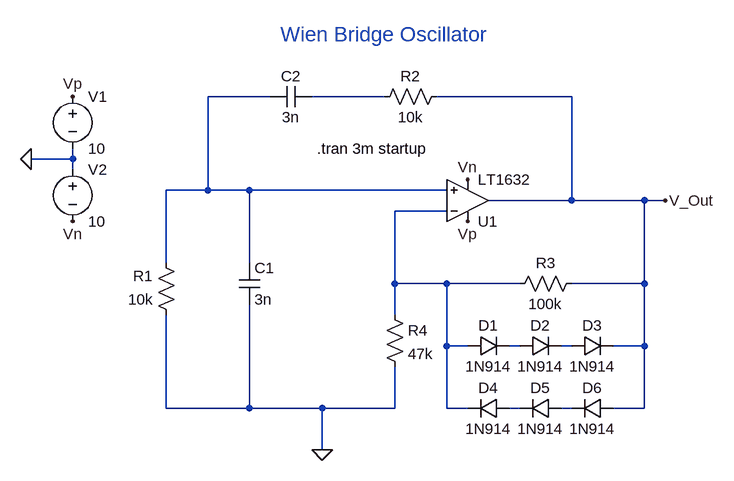
[diagram p0: schematic Wien_Bridge_Oscillator.asc]
Wien_Bridge_Oscillator.asc, the LTspice schematic file:
Version 4.1
SHEET 1 880 680
WIRE -16 0 -112 0
WIRE 160 0 48 0
WIRE 448 0 240 0
WIRE -320 96 -320 80
WIRE -320 96 -384 96
WIRE -320 112 -320 96
WIRE -112 144 -112 0
WIRE -112 144 -176 144
WIRE -48 144 -112 144
WIRE 256 144 -48 144
WIRE 448 160 448 0
WIRE 448 160 320 160
WIRE 560 160 448 160
WIRE 592 160 560 160
WIRE 256 176 176 176
WIRE -176 256 -176 144
WIRE -48 256 -48 144
WIRE 176 288 176 176
WIRE 256 288 176 288
WIRE 368 288 256 288
WIRE 560 288 560 160
WIRE 560 288 448 288
WIRE 176 336 176 288
WIRE 256 384 256 288
WIRE 288 384 256 384
WIRE 368 384 352 384
WIRE 448 384 432 384
WIRE 560 384 560 288
WIRE 560 384 512 384
WIRE -176 480 -176 336
WIRE -48 480 -48 320
WIRE -48 480 -176 480
WIRE 64 480 -48 480
WIRE 176 480 176 416
WIRE 176 480 64 480
WIRE 256 480 256 384
WIRE 288 480 256 480
WIRE 368 480 352 480
WIRE 448 480 432 480
WIRE 560 480 560 384
WIRE 560 480 512 480
WIRE 64 544 64 480
FLAG -320 0 Vp
FLAG 288 192 Vp
FLAG -320 192 Vn
FLAG 288 128 Vn
FLAG 592 160 V_Out
FLAG 64 544 0
FLAG -384 96 0
SYMBOL res 160 320 R0
SYMATTR InstName R4
SYMATTR Value 47k
SYMBOL res 256 -16 R90
WINDOW 0 0 56 VBottom 2
WINDOW 3 32 56 VTop 2
SYMATTR InstName R2
SYMATTR Value 10k
SYMBOL res -160 352 R180
WINDOW 0 36 76 Left 2
WINDOW 3 36 40 Left 2
SYMATTR InstName R1
SYMATTR Value 10k
SYMBOL cap -64 256 R0
SYMATTR InstName C1
SYMATTR Value 3n
SYMBOL cap 48 -16 R90
WINDOW 0 0 32 VBottom 2
WINDOW 3 32 32 VTop 2
SYMATTR InstName C2
SYMATTR Value 3n
SYMBOL voltage -320 -16 R0
WINDOW 123 0 0 Left 0
WINDOW 39 0 0 Left 0
SYMATTR InstName V1
SYMATTR Value 10
SYMBOL voltage -320 96 R0
WINDOW 123 0 0 Left 0
WINDOW 39 0 0 Left 0
SYMATTR InstName V2
SYMATTR Value 10
SYMBOL OpAmps\\LT1632 288 224 M180
SYMATTR InstName U1
SYMBOL res 352 304 R270
WINDOW 0 32 56 VTop 2
WINDOW 3 0 56 VBottom 2
SYMATTR InstName R3
SYMATTR Value 100k
SYMBOL diode 288 400 R270
WINDOW 0 32 32 VTop 2
WINDOW 3 0 32 VBottom 2
SYMATTR InstName D1
SYMATTR Value 1N914
SYMBOL diode 368 400 R270
WINDOW 0 32 32 VTop 2
WINDOW 3 0 32 VBottom 2
SYMATTR InstName D2
SYMATTR Value 1N914
SYMBOL diode 448 400 R270
WINDOW 0 32 32 VTop 2
WINDOW 3 0 32 VBottom 2
SYMATTR InstName D3
SYMATTR Value 1N914
SYMBOL diode 352 464 R90
WINDOW 0 0 32 VBottom 2
WINDOW 3 32 32 VTop 2
SYMATTR InstName D4
SYMATTR Value 1N914
SYMBOL diode 432 464 R90
WINDOW 0 0 32 VBottom 2
WINDOW 3 32 32 VTop 2
SYMATTR InstName D5
SYMATTR Value 1N914
SYMBOL diode 512 464 R90
WINDOW 0 0 32 VBottom 2
WINDOW 3 32 32 VTop 2
SYMATTR InstName D6
SYMATTR Value 1N914
TEXT 56 80 Left 2 !.tran 3m startup
TEXT 0 -96 Left 3 ;Wien Bridge Oscillator

The netlist it stands for:
* Wien_Bridge_Oscillator.asc
R4 N003 0 47k
R2 V_Out N002 10k
R1 0 N001 10k
C1 N001 0 3n
C2 N002 N001 3n
V1 Vp 0 10
V2 0 Vn 10
X§U1 N001 N003 Vp Vn V_Out LT1632  ; pins In+ In- V+ V- OUT
R3 N003 V_Out 100k
D1 N003 N004 1N914
D2 N004 N005 1N914
D3 N005 V_Out 1N914
D4 N006 N003 1N914
D5 N007 N006 1N914
D6 V_Out N007 1N914
.model D D
.lib standard.dio
.tran 3m startup
* Wien Bridge Oscillator
.lib LTC.lib
.backanno
.end